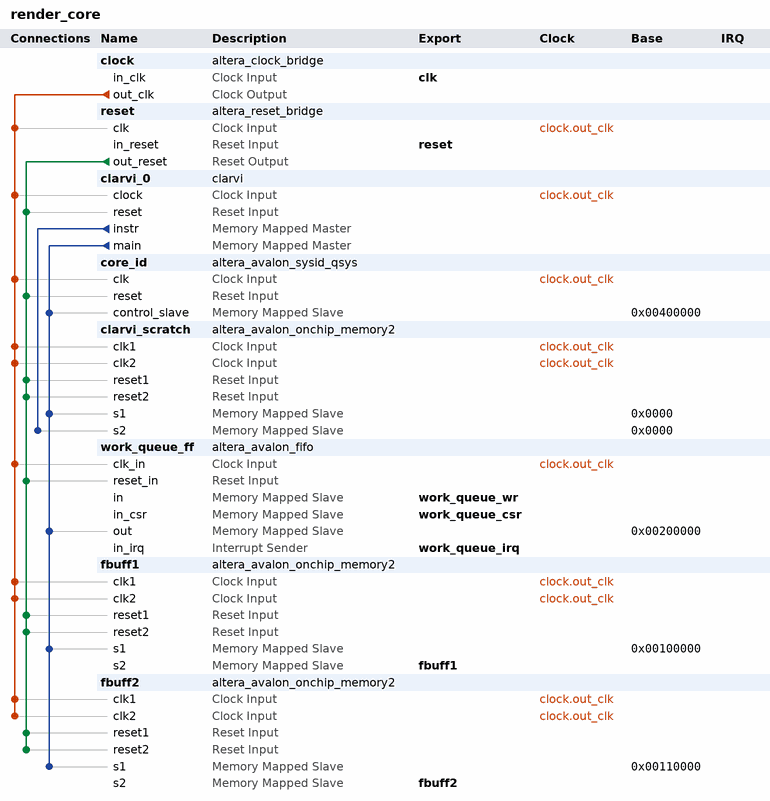
[diagram p0: system contents]
# Platform Designer (Qsys) system render_core, Cyclone IV GX EP4CGX150DF31C7
# Parameters at their usual value, and those the tool derives, are not listed.
package require -exact qsys 16.1
create_system render_core
set_project_property DEVICE_FAMILY {Cyclone IV GX}
set_project_property DEVICE EP4CGX150DF31C7

add_instance clock altera_clock_bridge 16.1
set_instance_parameter_value clock DERIVED_CLOCK_RATE 0
set_instance_parameter_value clock EXPLICIT_CLOCK_RATE 0

add_instance reset altera_reset_bridge 16.1
set_instance_parameter_value reset ACTIVE_LOW_RESET 0
set_instance_parameter_value reset SYNCHRONOUS_EDGES deassert

add_instance clarvi_0 clarvi 1.0
set_instance_parameter_value clarvi_0 DATA_ADDR_WIDTH 29
set_instance_parameter_value clarvi_0 DEFAULT_TRAP_VECTOR 0
set_instance_parameter_value clarvi_0 INITIAL_PC 0
set_instance_parameter_value clarvi_0 INSTR_ADDR_WIDTH 29

add_instance core_id altera_avalon_sysid_qsys 16.1
set_instance_parameter_value core_id id 0

add_instance clarvi_scratch altera_avalon_onchip_memory2 16.1
set_instance_parameter_value clarvi_scratch dataWidth 32
set_instance_parameter_value clarvi_scratch dualPort true
set_instance_parameter_value clarvi_scratch initMemContent true
set_instance_parameter_value clarvi_scratch initializationFileName mem.hex
set_instance_parameter_value clarvi_scratch memorySize 4096
set_instance_parameter_value clarvi_scratch useNonDefaultInitFile true

add_instance work_queue_ff altera_avalon_fifo 16.1
set_instance_parameter_value work_queue_ff bitsPerSymbol 16
set_instance_parameter_value work_queue_ff channelWidth 8
set_instance_parameter_value work_queue_ff errorWidth 8
set_instance_parameter_value work_queue_ff fifoDepth 128
set_instance_parameter_value work_queue_ff fifoInputInterfaceOptions AVALONMM_WRITE
set_instance_parameter_value work_queue_ff fifoOutputInterfaceOptions AVALONMM_READ
set_instance_parameter_value work_queue_ff singleClockMode true
set_instance_parameter_value work_queue_ff symbolsPerBeat 2
set_instance_parameter_value work_queue_ff useIRQ true
set_instance_parameter_value work_queue_ff usePacket true
set_instance_parameter_value work_queue_ff useReadControl false

add_instance fbuff1 altera_avalon_onchip_memory2 16.1
set_instance_parameter_value fbuff1 dataWidth 32
set_instance_parameter_value fbuff1 dualPort true
set_instance_parameter_value fbuff1 initMemContent true
set_instance_parameter_value fbuff1 initializationFileName onchip_mem.hex
set_instance_parameter_value fbuff1 memorySize 32640

add_instance fbuff2 altera_avalon_onchip_memory2 16.1
set_instance_parameter_value fbuff2 dataWidth 32
set_instance_parameter_value fbuff2 dualPort true
set_instance_parameter_value fbuff2 initMemContent true
set_instance_parameter_value fbuff2 initializationFileName onchip_mem.hex
set_instance_parameter_value fbuff2 memorySize 32640

# connections
add_connection clock.out_clk clarvi_0.clock clock
add_connection clock.out_clk clarvi_scratch.clk1 clock
add_connection clock.out_clk clarvi_scratch.clk2 clock
add_connection clock.out_clk core_id.clk clock
add_connection clock.out_clk fbuff1.clk1 clock
add_connection clock.out_clk fbuff1.clk2 clock
add_connection clock.out_clk fbuff2.clk1 clock
add_connection clock.out_clk fbuff2.clk2 clock
add_connection clock.out_clk reset.clk clock
add_connection clock.out_clk work_queue_ff.clk_in clock
add_connection reset.out_reset clarvi_0.reset reset
add_connection reset.out_reset clarvi_scratch.reset1 reset
add_connection reset.out_reset clarvi_scratch.reset2 reset
add_connection reset.out_reset core_id.reset reset
add_connection reset.out_reset fbuff1.reset1 reset
add_connection reset.out_reset fbuff1.reset2 reset
add_connection reset.out_reset fbuff2.reset1 reset
add_connection reset.out_reset fbuff2.reset2 reset
add_connection reset.out_reset work_queue_ff.reset_in reset
add_connection clarvi_0.instr clarvi_scratch.s2 avalon
set_connection_parameter_value clarvi_0.instr/clarvi_scratch.s2 baseAddress 0x0000
add_connection clarvi_0.main clarvi_scratch.s1 avalon
set_connection_parameter_value clarvi_0.main/clarvi_scratch.s1 baseAddress 0x0000
add_connection clarvi_0.main core_id.control_slave avalon
set_connection_parameter_value clarvi_0.main/core_id.control_slave baseAddress 0x00400000
add_connection clarvi_0.main fbuff1.s1 avalon
set_connection_parameter_value clarvi_0.main/fbuff1.s1 baseAddress 0x00100000
add_connection clarvi_0.main fbuff2.s1 avalon
set_connection_parameter_value clarvi_0.main/fbuff2.s1 baseAddress 0x00110000
add_connection clarvi_0.main work_queue_ff.out avalon
set_connection_parameter_value clarvi_0.main/work_queue_ff.out baseAddress 0x00200000

# exported interfaces
add_interface clk clock sink
set_interface_property clk EXPORT_OF clock.in_clk
add_interface fbuff1 avalon slave
set_interface_property fbuff1 EXPORT_OF fbuff1.s2
add_interface fbuff2 avalon slave
set_interface_property fbuff2 EXPORT_OF fbuff2.s2
add_interface reset reset sink
set_interface_property reset EXPORT_OF reset.in_reset
add_interface work_queue_csr avalon slave
set_interface_property work_queue_csr EXPORT_OF work_queue_ff.in_csr
add_interface work_queue_irq interrupt sender
set_interface_property work_queue_irq EXPORT_OF work_queue_ff.in_irq
add_interface work_queue_wr avalon slave
set_interface_property work_queue_wr EXPORT_OF work_queue_ff.in

set_interconnect_requirement {$system} qsys_mm.clockCrossingAdapter HANDSHAKE
set_interconnect_requirement {$system} qsys_mm.enableEccProtection FALSE
set_interconnect_requirement {$system} qsys_mm.insertDefaultSlave FALSE
set_interconnect_requirement {$system} qsys_mm.maxAdditionalLatency 1

save_system render_core.qsys
